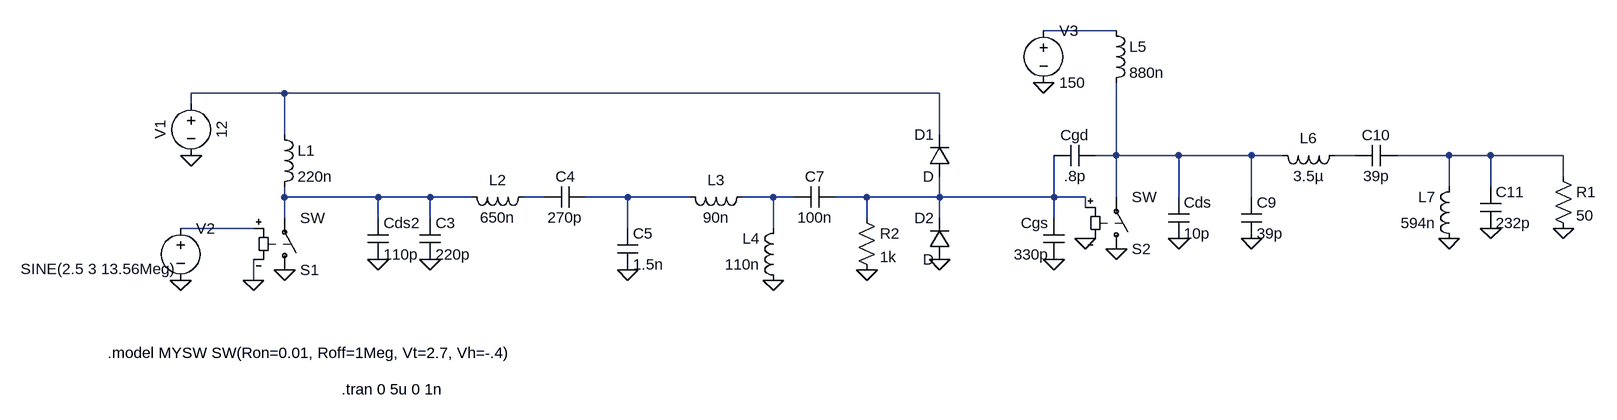
[diagram p0: schematic rf_gen.asc]
rf_gen.asc, the LTspice schematic file:
Version 4
SHEET 1 2104 680
WIRE 1360 -128 1248 -128
WIRE 80 -32 -64 -32
WIRE 1088 -32 80 -32
WIRE -64 -16 -64 -32
WIRE 80 32 80 -32
WIRE 1088 32 1088 -32
WIRE 1360 64 1360 -48
WIRE 1360 64 1328 64
WIRE 1456 64 1360 64
WIRE 1568 64 1456 64
WIRE 1616 64 1568 64
WIRE 1728 64 1696 64
WIRE 1872 64 1792 64
WIRE 1936 64 1872 64
WIRE 2048 64 1936 64
WIRE 2048 96 2048 64
WIRE 1872 112 1872 64
WIRE 1936 112 1936 64
WIRE 80 128 80 112
WIRE 224 128 80 128
WIRE 304 128 224 128
WIRE 368 128 304 128
WIRE 480 128 448 128
WIRE 608 128 544 128
WIRE 704 128 608 128
WIRE 832 128 784 128
WIRE 864 128 832 128
WIRE 976 128 928 128
WIRE 1088 128 1088 96
WIRE 1088 128 976 128
WIRE 1264 128 1264 64
WIRE 1264 128 1088 128
WIRE 1312 128 1264 128
WIRE 1360 128 1360 64
WIRE 1456 128 1456 64
WIRE 1568 128 1568 64
WIRE 1312 144 1312 128
WIRE 80 160 80 128
WIRE 224 160 224 128
WIRE 304 160 304 128
WIRE 976 160 976 128
WIRE 1088 160 1088 128
WIRE 1264 160 1264 128
WIRE 32 176 -80 176
WIRE 608 176 608 128
WIRE 832 176 832 128
WIRE 32 256 32 224
FLAG 1264 224 0
FLAG 832 256 0
FLAG 608 240 0
FLAG 304 224 0
FLAG 80 240 0
FLAG -80 256 0
FLAG 32 256 0
FLAG 224 224 0
FLAG 1088 224 0
FLAG -64 64 0
FLAG 1360 208 0
FLAG 1312 192 0
FLAG 1248 -48 0
FLAG 2048 176 0
FLAG 1936 176 0
FLAG 1872 192 0
FLAG 1456 192 0
FLAG 1568 192 0
FLAG 976 240 0
SYMBOL sw 80 256 M180
SYMATTR InstName S1
SYMATTR SpiceModel MYSW
SYMBOL ind 64 16 R0
SYMATTR InstName L1
SYMATTR Value 220n
SYMATTR SpiceLine Rser=11m
SYMBOL ind 464 112 R90
WINDOW 0 5 56 VBottom 2
WINDOW 3 32 56 VTop 2
SYMATTR InstName L2
SYMATTR Value 650n
SYMATTR SpiceLine Rser=45m
SYMBOL ind 800 112 R90
WINDOW 0 5 56 VBottom 2
WINDOW 3 32 56 VTop 2
SYMATTR InstName L3
SYMATTR Value 90n
SYMATTR SpiceLine Rser=5.5m
SYMBOL ind 848 272 R180
WINDOW 0 36 80 Left 2
WINDOW 3 36 40 Left 2
SYMATTR InstName L4
SYMATTR Value 110n
SYMATTR SpiceLine Rser=6.5m
SYMBOL cap 592 176 R0
SYMATTR InstName C5
SYMATTR Value 1.5n
SYMBOL cap 288 160 R0
SYMATTR InstName C3
SYMATTR Value 220p
SYMBOL cap 928 112 R90
WINDOW 0 0 32 VBottom 2
WINDOW 3 32 32 VTop 2
SYMATTR InstName C7
SYMATTR Value 100n
SYMBOL cap 1280 224 R180
WINDOW 0 24 56 Left 2
WINDOW 3 24 8 Left 2
SYMATTR InstName Cgs
SYMATTR Value 330p
SYMBOL voltage -64 -32 R0
WINDOW 0 -32 56 VBottom 2
WINDOW 3 32 56 VTop 2
WINDOW 123 0 0 Left 0
WINDOW 39 0 0 Left 0
SYMATTR InstName V1
SYMATTR Value 12
SYMBOL voltage -80 160 R0
WINDOW 3 -246 79 Left 2
WINDOW 123 0 0 Left 0
WINDOW 39 0 0 Left 0
SYMATTR InstName V2
SYMATTR Value SINE(2.5 3 13.56Meg)
SYMBOL cap 544 112 R90
WINDOW 0 0 32 VBottom 2
WINDOW 3 32 32 VTop 2
SYMATTR InstName C4
SYMATTR Value 270p
SYMBOL cap 208 160 R0
SYMATTR InstName Cds2
SYMATTR Value 110p
SYMBOL diode 1104 96 R180
WINDOW 0 24 64 Left 2
WINDOW 3 24 0 Left 2
SYMATTR InstName D1
SYMBOL diode 1104 224 R180
WINDOW 0 24 64 Left 2
WINDOW 3 24 0 Left 2
SYMATTR InstName D2
SYMBOL sw 1360 224 M180
SYMATTR InstName S2
SYMATTR SpiceModel MYSW
SYMBOL ind 1344 -144 R0
SYMATTR InstName L5
SYMATTR Value 880n
SYMATTR SpiceLine Rser=50m
SYMBOL voltage 1248 -144 R0
WINDOW 123 0 0 Left 0
WINDOW 39 0 0 Left 0
SYMATTR InstName V3
SYMATTR Value 150
SYMBOL cap 1440 128 R0
SYMATTR InstName Cds
SYMATTR Value 10p
SYMBOL cap 1552 128 R0
SYMATTR InstName C9
SYMATTR Value 39p
SYMBOL ind 1712 48 R90
WINDOW 0 5 56 VBottom 2
WINDOW 3 32 56 VTop 2
SYMATTR InstName L6
SYMATTR Value 3.5µ
SYMATTR SpiceLine Rser=100m
SYMBOL ind 1888 208 R180
WINDOW 0 36 80 Left 2
WINDOW 3 36 40 Left 2
SYMATTR InstName L7
SYMATTR Value 594n
SYMATTR SpiceLine Rser=40m
SYMBOL cap 1920 112 R0
SYMATTR InstName C11
SYMATTR Value 232p
SYMBOL cap 1792 48 R90
WINDOW 0 0 32 VBottom 2
WINDOW 3 32 32 VTop 2
SYMATTR InstName C10
SYMATTR Value 39p
SYMBOL res 2032 80 R0
SYMATTR InstName R1
SYMATTR Value 50
SYMBOL res 960 144 R0
SYMATTR InstName R2
SYMATTR Value 1k
SYMBOL cap 1328 48 R90
WINDOW 0 0 32 VBottom 2
WINDOW 3 32 32 VTop 2
SYMATTR InstName Cgd
SYMATTR Value .8p
TEXT -192 368 Left 2 !.model MYSW SW(Ron=0.01, Roff=1Meg, Vt=2.7, Vh=-.4)
TEXT 168 424 Left 2 !.tran 0 5u 0 1n

The netlist it stands for:
* rf_gen.asc
S1 0 N006 N011 0 MYSW SW
L1 N002 N006 220n Rser=11m
L2 N007 N006 650n Rser=45m
L3 N009 N008 90n Rser=5.5m
L4 0 N009 110n Rser=6.5m
C5 N008 0 1.5n
C3 N006 0 220p
C7 N010 N009 100n
Cgs 0 N010 330p
V1 N002 0 12
V2 N011 0 SINE(2.5 3 13.56Meg)
C4 N008 N007 270p
Cds2 N006 0 110p
D1 N010 N002 D
D2 0 N010 D
S2 0 N003 N010 0 MYSW SW
L5 N001 N003 880n Rser=50m
V3 N001 0 150
Cds N003 0 10p
C9 N003 0 39p
L6 N004 N003 3.5µ Rser=100m
L7 0 N005 594n Rser=40m
C11 N005 0 232p
C10 N005 N004 39p
R1 N005 0 50
R2 N010 0 1k
Cgd N003 N010 .8p
.model D D
.lib standard.dio
.model MYSW SW(Ron=0.01, Roff=1Meg, Vt=2.7, Vh=-.4)
.tran 0 5u 0 1n
.backanno
.end